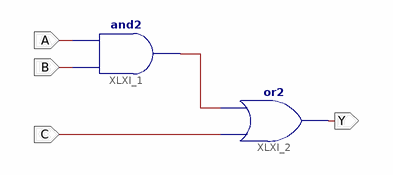
[diagram p0: schematic sheet 1]
// Xilinx ISE schematic circuit1.sch (spartan3e) as structural Verilog: 2 symbols, 4 ports
module circuit1 (
  input  A,
  input  B,
  input  C,
  output Y
);

  wire XLXN_14;

  and XLXI_1 (XLXN_14, B, A);
  or XLXI_2 (Y, C, XLXN_14);
endmodule
